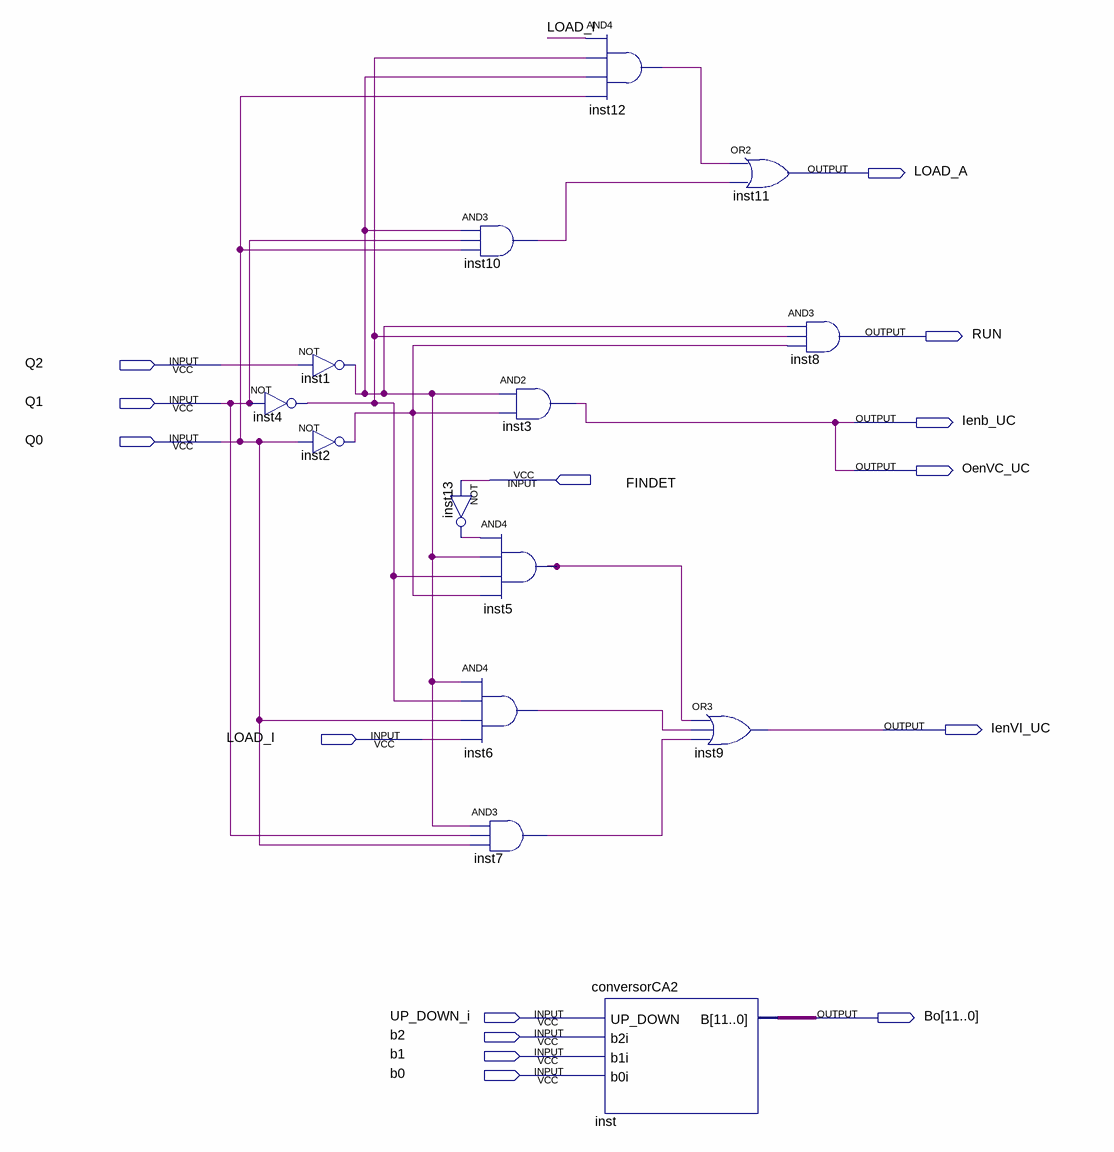
[diagram p0: schematic sheet]
// Quartus schematic UC_de_UC.bdf as structural Verilog: 14 symbols, 15 pins
module UC_de_UC (
  input  Q2,
  input  Q1,
  input  Q0,
  input  FINDET,
  input  LOAD_I,
  input  UP_DOWN_i,
  input  b2,
  input  b1,
  input  b0,
  output LOAD_A,
  output RUN,
  output Ienb_UC,
  output OenVC_UC,
  output IenVI_UC,
  output [11:0] Bo
);

  wire inst1_out, inst2_out, inst4_out, inst5_out, inst6_out, inst7_out, inst10_out, inst12_out, inst13_out;

  not inst4 (inst4_out, Q1);
  not inst1 (inst1_out, Q2);
  not inst2 (inst2_out, Q0);
  and inst10 (inst10_out, inst1_out, Q1, Q0);
  not inst13 (inst13_out, FINDET);
  and inst5 (inst5_out, inst13_out, inst1_out, inst4_out, inst2_out);
  and inst6 (inst6_out, inst1_out, inst4_out, Q0, LOAD_I);
  and inst7 (inst7_out, inst1_out, Q1, Q0);
  and inst3 (Ienb_UC, inst1_out, inst2_out);
  and inst12 (inst12_out, LOAD_I, inst4_out, inst1_out, Q0);
  conversorCA2 inst (.UP_DOWN(UP_DOWN_i), .b2i(b2), .b1i(b1), .b0i(b0), .B(Bo));
  or inst9 (IenVI_UC, inst5_out, inst6_out, inst7_out);
  or inst11 (LOAD_A, inst12_out, inst10_out);
  and inst8 (RUN, inst1_out, inst4_out, inst2_out);

  assign OenVC_UC = Ienb_UC;
endmodule
